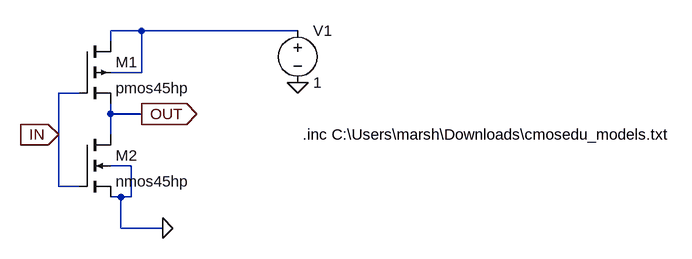
[diagram p0: schematic inva3.asc]
inva3.asc, the LTspice schematic file:
Version 4.1
SHEET 1 928 680
WIRE 48 -80 0 -80
WIRE 288 -80 48 -80
WIRE 0 -64 0 -80
WIRE 48 -16 48 -80
WIRE 48 -16 0 -16
WIRE -48 16 -80 16
WIRE 0 48 0 32
WIRE 48 48 0 48
WIRE -80 80 -80 16
WIRE 0 80 0 48
WIRE 32 128 0 128
WIRE -80 160 -80 80
WIRE -48 160 -80 160
WIRE 16 176 0 176
WIRE 32 176 32 128
WIRE 32 176 16 176
WIRE 16 224 16 176
WIRE 80 224 16 224
FLAG -80 80 IN
IOPIN -80 80 In
FLAG 48 48 OUT
IOPIN 48 48 Out
FLAG 288 0 0
FLAG 80 224 0
SYMBOL pmos4 -48 -64 R0
SYMATTR InstName M1
SYMATTR Value pmos45hp
SYMATTR Value2 l=100n w=900n
SYMBOL nmos4 -48 80 R0
SYMATTR InstName M2
SYMATTR Value nmos45hp
SYMATTR Value2 l=100n w=600n
SYMBOL voltage 288 -96 R0
WINDOW 123 0 0 Left 0
WINDOW 39 0 0 Left 0
SYMATTR InstName V1
SYMATTR Value 1
TEXT 296 80 Left 2 !.inc C:\\Users\\marsh\\Downloads\\cmosedu_models.txt

The netlist it stands for:
* inva3.asc
M1 N001 IN OUT N001 pmos45hp l=100n w=900n
M2 OUT IN 0 0 nmos45hp l=100n w=600n
V1 N001 0 1
.model NMOS NMOS
.model PMOS PMOS
.lib standard.mos
.inc C:\Users\marsh\Downloads\cmosedu_models.txt
.backanno
.end